# EasyEDA Pro project ProPrj_NE564_2025-07-16.epro

# Schematic NE564
Board Name: NE564; Create Date: 2025-07-15; Page Name: Sheet_1; Project Name: NE564; Schematic Name: NE564; Update Date: 2025-07-15; Add into BOM: yes; Company: NJU 2022; Convert to PCB: yes; Date: 2022-07-18; Draw By: Klein; REV: 1.0; Sheet: 1/1; spicePre: .
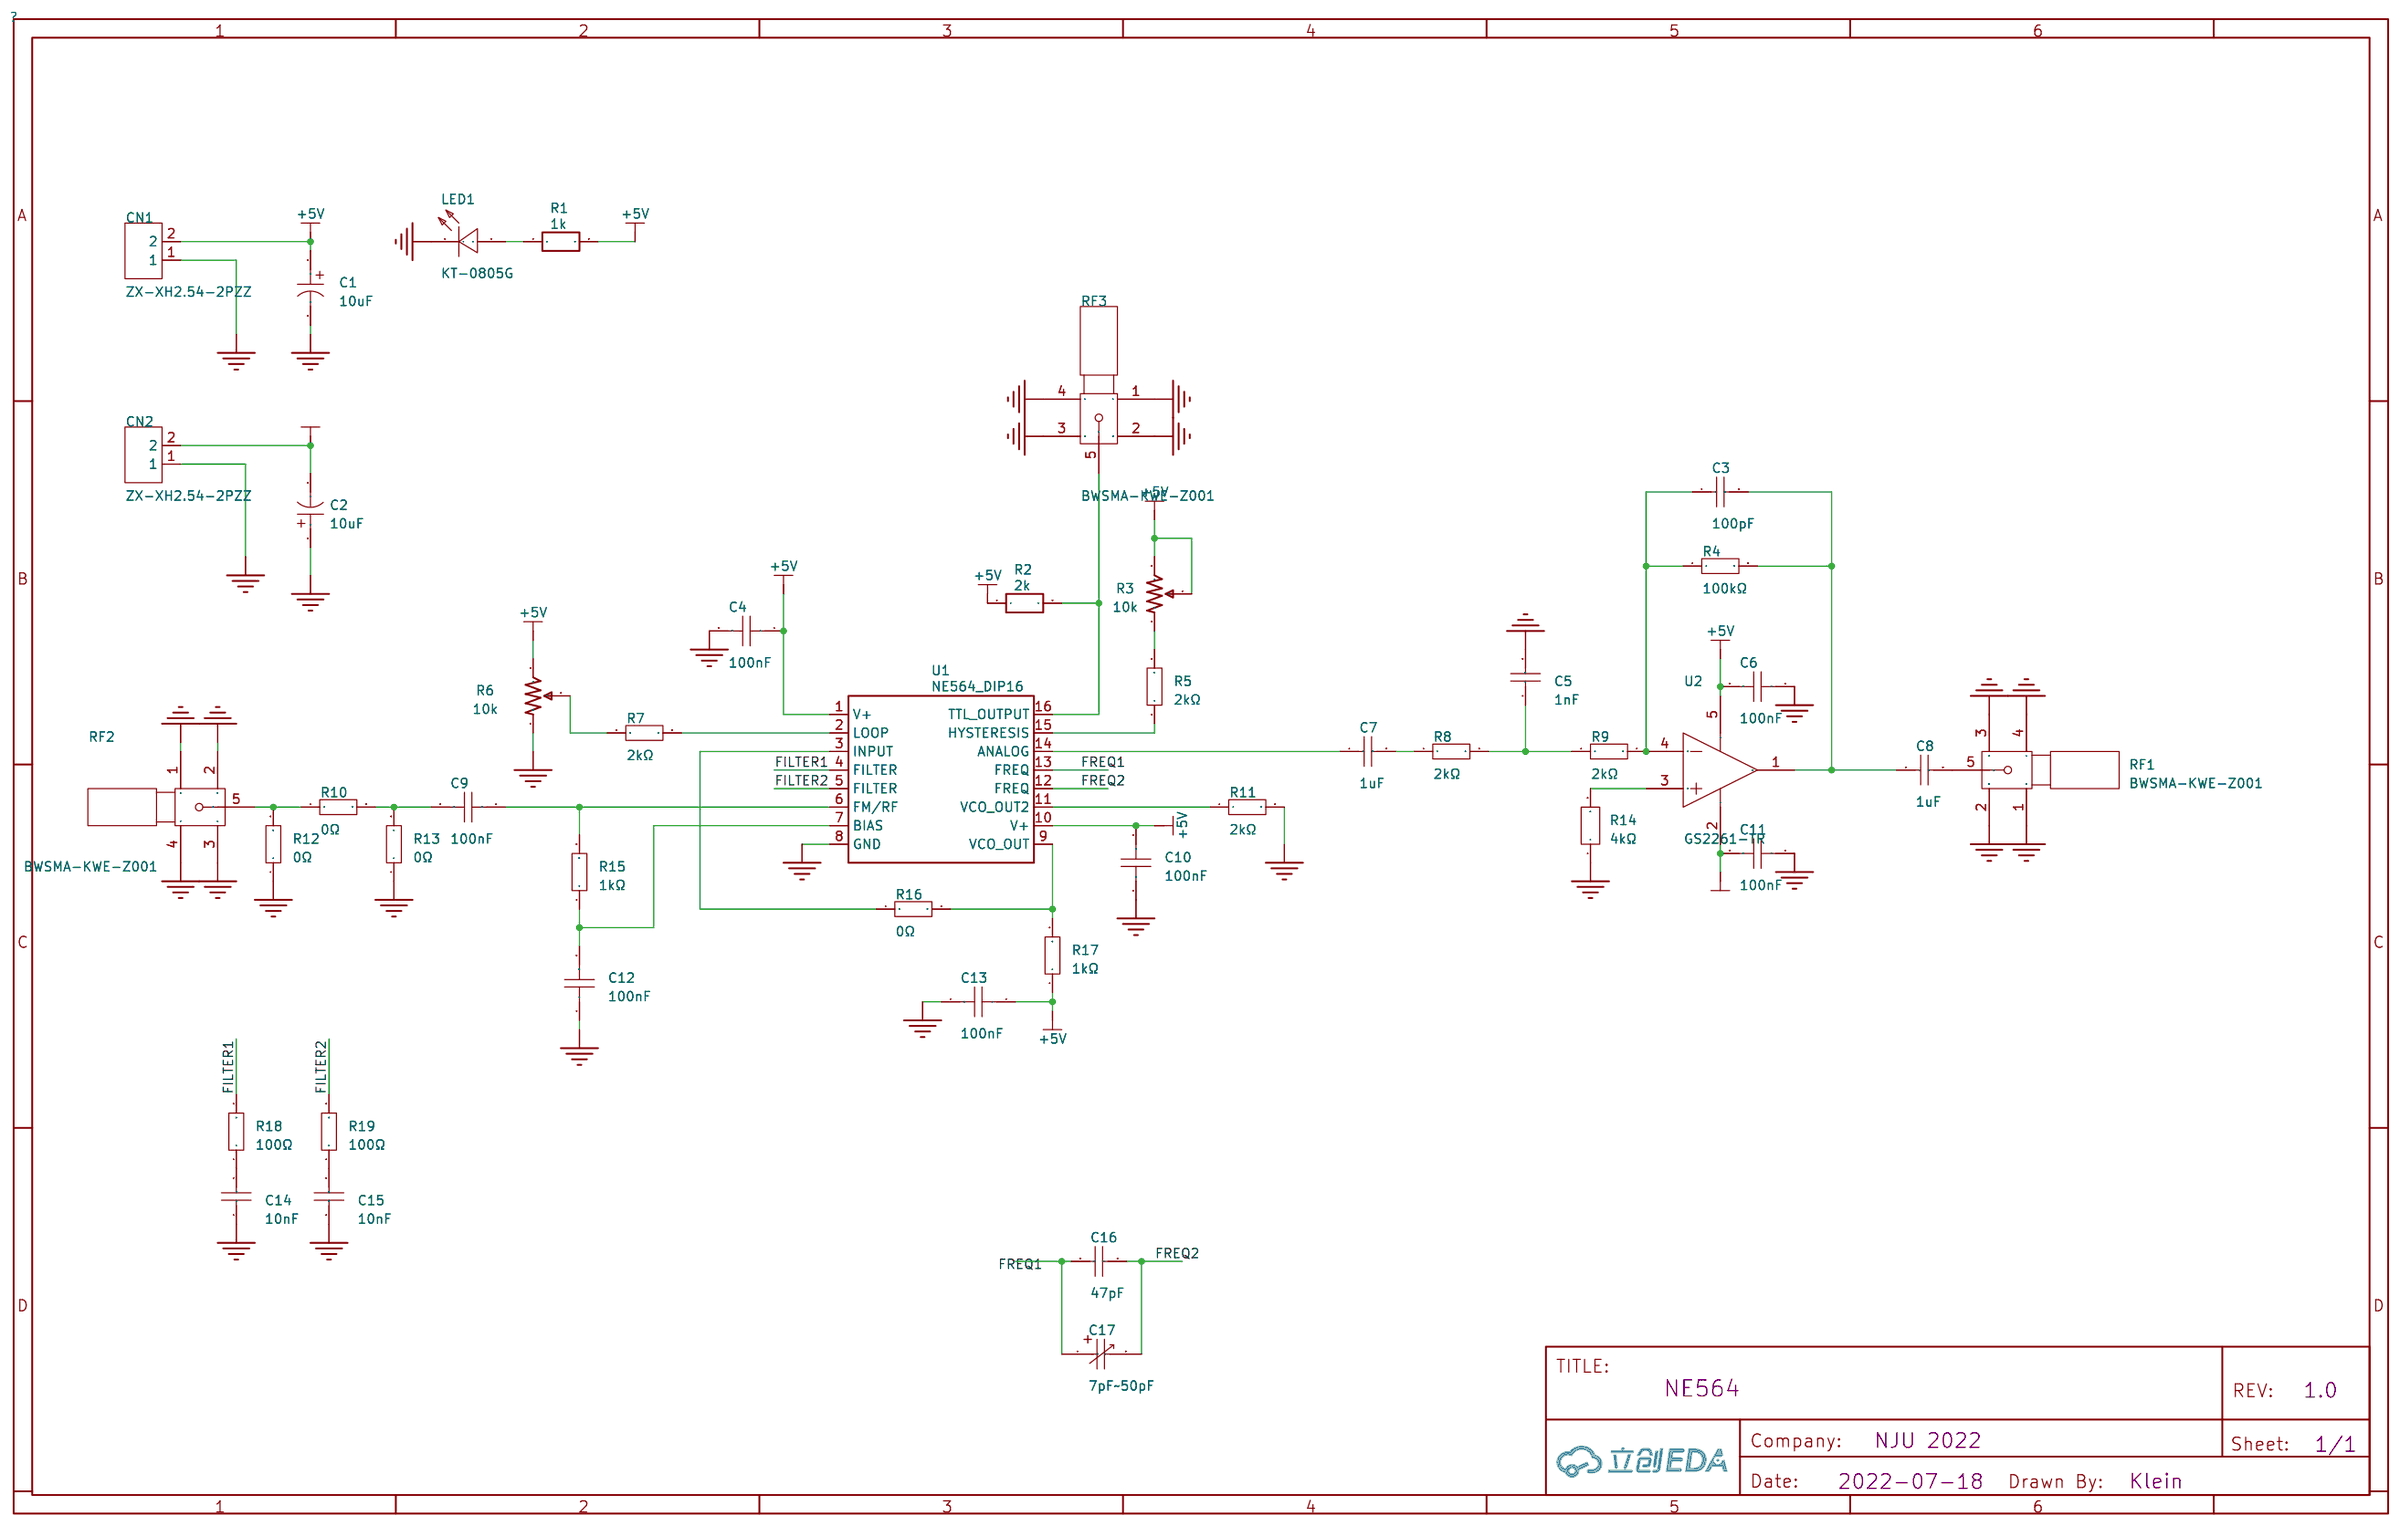
[diagram p0: schematic sheet]

## Parts
C1  10uF  [CAP-SMD_BD5.0-L5.3-W5.3-LS6.0-FD]
C2  10uF  [CAP-SMD_BD5.0-L5.3-W5.3-LS6.0-FD]
C3  100pF  [C0603]
C4  100nF  [C0805]
C5  1nF  [C0805]
C6  100nF  [C0805]
C7  1uF  [C0805]
C8  1uF  [C0805]
C9  100nF  [C0805]
C10  100nF  [C0805]
C11  100nF  [C0805]
C12  100nF  [C0805]
C13  100nF  [C0805]
C14  10nF  [C0805]
C15  10nF  [C0805]
C16  47pF  [C0805]
C17  7pF~50pF  [CAP-ADJ-SMD_L4.5-W4.2-L]
CN1  ZX-XH2.54-2PZZ  [CONN-TH_2P-P2.50_HX25003-2A]
CN2  ZX-XH2.54-2PZZ  [CONN-TH_2P-P2.50_HX25003-2A]
LED1  KT-0805G  [LED0805-R-RD]
R1  1k  [R0805]
R2  2k  [R0805]
R3  10k  [RES-ADJ-TH_3296W]
R4  100kΩ  [R0805]
R5  2kΩ  [R0805]
R6  10k  [RES-ADJ-TH_3296W]
R7  2kΩ  [R0805]
R8  2kΩ  [R0805]
R9  2kΩ  [R0805]
R10  0Ω  [R0805]
R11  2kΩ  [R0805]
R12  0Ω  [R0805]
R13  0Ω  [R0805]
R14  4kΩ  [R0805]
R15  1kΩ  [R0805]
R16  0Ω  [R0805]
R17  1kΩ  [R0805]
R18  100Ω  [R0805]
R19  100Ω  [R0805]
RF1  BWSMA-KWE-Z001  [SMA-TH_BWSMA-KWE-Z001]
RF2  BWSMA-KWE-Z001  [SMA-TH_BWSMA-KWE-Z001]
RF3  BWSMA-KWE-Z001  [SMA-TH_BWSMA-KWE-Z001]
U1  NE564_DIP16  [DIP16]
U2  GS2261-TR  [SOT-23-5_L3.0-W1.7-P0.95-LS2.8-BL]

## Library data of the parts
C1 C2 = JVJ50v10M5x5: 容值:10uF;精度:±20%;额定电压:50V;纹波电流:18mA@120Hz;; LCSC Part Name: 10uF ±20% 50V; Supplier Part: C46550416; Manufacturer: 捷而瑞; Supplier Footprint: SMD,D5xL5.4mm; JLCPCB Part Class: 扩展库; Datasheet: https://atta.szlcsc.com/upload/public/pdf/source/20250526/372E583B5965CEB57A276EA554306514.pdf; Supplier: LCSC; Tolerance: ±20%; Voltage Rating: 50V; Ripple Current: 18mA@120Hz; Diameter: 5mm; Height - Seated (Max): 5.4mm; Operating Temperature: -55℃~+105℃
C3 = CL10C101JB8NNNC: 容值:100pF;精度:±5%;额定电压:50V;材质(温度系数):C0G;; LCSC Part Name: 100pF ±5% 50V; Supplier Part: C14858; Manufacturer: SAMSUNG(三星); Supplier Footprint: 0603; JLCPCB Part Class: 基础库; Datasheet: https://atta.szlcsc.com/upload/public/pdf/source/20160218/1457707763339.pdf; Supplier: LCSC; Tolerance: ±5%; Voltage Rated: 50V; Temperature Coefficient: C0G
C4 C6 C9-C13 = CC0805KRX7R9BB104: 容值:100nF;精度:±10%;额定电压:50V;材质(温度系数):X7R;; LCSC Part Name: 100nF ±10% 50V; Supplier Part: C49678; Manufacturer: YAGEO(国巨); Supplier Footprint: 0805; JLCPCB Part Class: 基础库; Datasheet: https://atta.szlcsc.com/upload/public/pdf/source/20180224/C181747_15194369449651363981.pdf; Supplier: LCSC; Tolerance: ±10%; Voltage Rated: 50V; Temperature Coefficient: X7R
C5 = CL21B102KBCNNNC: 容值:1nF;精度:±10%;额定电压:50V;材质(温度系数):X7R;; LCSC Part Name: 1nF ±10% 50V; Supplier Part: C46653; Manufacturer: SAMSUNG(三星); Supplier Footprint: 0805; JLCPCB Part Class: 基础库; Datasheet: https://atta.szlcsc.com/upload/public/pdf/source/20160218/1457707763339.pdf; Supplier: LCSC; Tolerance: ±10%; Voltage Rated: 50V; Temperature Coefficient: X7R
C7 C8 = CL21B105KBFNNNE: 容值:1uF;精度:±10%;额定电压:50V;材质(温度系数):X7R;; LCSC Part Name: 1uF ±10% 50V; Supplier Part: C28323; Manufacturer: SAMSUNG(三星); Supplier Footprint: 0805; JLCPCB Part Class: 基础库; Datasheet: https://atta.szlcsc.com/upload/public/pdf/source/20160218/1457707763339.pdf; Supplier: LCSC; Tolerance: ±10%; Voltage Rated: 50V; Temperature Coefficient: X7R
C14 C15 = CL21B103KBANNNC: 容值:10nF;精度:±10%;额定电压:50V;材质(温度系数):X7R;; LCSC Part Name: 10nF ±10% 50V; Supplier Part: C1710; Manufacturer: SAMSUNG(三星); Supplier Footprint: 0805; JLCPCB Part Class: 基础库; Datasheet: https://atta.szlcsc.com/upload/public/pdf/source/20160218/1457707763339.pdf; Supplier: LCSC; Tolerance: ±10%; Voltage Rated: 50V; Temperature Coefficient: X7R
C16 = CL21C470JBANNNC: 容值:47pF;精度:±5%;额定电压:50V;材质(温度系数):C0G;; LCSC Part Name: 47pF ±5% 50V; Supplier Part: C14857; Manufacturer: SAMSUNG(三星); Supplier Footprint: 0805; JLCPCB Part Class: 基础库; Datasheet: https://atta.szlcsc.com/upload/public/pdf/source/20160218/1457707763339.pdf; Supplier: LCSC; Tolerance: ±5%; Voltage Rated: 50V; Temperature Coefficient: C0G
C17 = TZB4R500AB10R00: 静电容量:7pF~50pF;静电容量公差:0%~+100%;额定电压:50V;电荷量:300@1MHz;; LCSC Part Name: 7pF~50pF 0%~+100% 50V 300@1MHz; Supplier Part: C125363; Manufacturer: muRata(村田); Supplier Footprint: SMD,4x4.5mm; JLCPCB Part Class: 扩展库; Datasheet: https://atta.szlcsc.com/upload/public/pdf/source/20170810/C125363_1502335363337879940.pdf; Supplier: LCSC; Tolerance: 0%~+100%; Voltage Rating: 50V; Q @ Frequency: 300@1MHz; Operating Temperature: -25℃~+85℃
CN1 CN2 = ZX-XH2.54-2PZZ: 插针结构:1x2P;间距:2.5mm;安装方式:直插;参考系列:XH;总PIN数:2P;排数:1;每排PIN数:2;行距:-;额定电流:3A;触头材质:黄铜;触头镀层:锡;工作温度:-25℃~+85℃;; LCSC Part Name: 1x2P 间距:2.5mm 直插 系列:XH; Supplier Part: C7429632; Manufacturer: Megastar(兆星); Supplier Footprint: 插件,P=2.5mm; JLCPCB Part Class: 扩展库; Datasheet: https://atta.szlcsc.com/upload/public/pdf/source/20230619/19BA6947230AA44A04D3EDD65E618FD0.pdf; Supplier: LCSC; Pins Structure: 1x2P; Pitch: 2.5mm; Mounting Type: 直插; Reference Series: XH; Number of Pins: 2P; Number of Rows: 1; Number of PINs Per Row: 2; Current Rating: 3A; Contact Material: 黄铜; Contact Plating: 锡; Operating Temperature: -25℃~+85℃; Voltage Rating: 250V; Plastic Material: PA66; Flame Retardant Rating: UL94V-0; Color: 白色; Z-Height of the Board: 7mm; X-Length of Bottom Edge on Board (Spacing Line): 7.5mm; Y-Width of Bottom Edge on Board: 5.9mm
LED1 = KT-0805G: 灯头类型:-;发光颜色:翠绿色;正向电压(VF):-;功率:-;正向电流:-;主波长:-;二极管配置:-;透镜颜色:-;色温:-;发光强度:-;发光角度:-;载带方式:-;工作温度:-;; LCSC Part Name: 0805 翠绿 高亮; Supplier Part: C2297; Manufacturer: KENTO; Supplier Footprint: 0805; JLCPCB Part Class: 基础库; Datasheet: https://atta.szlcsc.com/upload/public/pdf/source/20170209/1486607340485.pdf; Supplier: LCSC; Emitted Color: 翠绿色
R1 = 1k: nameAlias: Value(Ω); Contributor: LCEDA_Lib; spicePre: R; spiceSymbolName: R_0805_EU
R2 = 2k: nameAlias: Value(Ω); Contributor: LCEDA_Lib; spicePre: R; spiceSymbolName: R_0805_EU
R3 R6 = 10k: Supplier: LCSC; value(Ω): 10K; nameAlias: Value; Contributor: LCEDA_Lib; spicePre: R; spiceSymbolName: R_3296W_US
R4 = 0805W8F1003T5E: 电阻类型:厚膜电阻;阻值:100kΩ;精度:±1%;功率:125mW;最大工作电压:150V;温度系数:±100ppm/℃;; LCSC Part Name: 100kΩ ±1% 125mW 厚膜电阻; Supplier Part: C149504; Manufacturer: UNI-ROYAL(厚声); Supplier Footprint: 0805; JLCPCB Part Class: 基础库; Datasheet: https://atta.szlcsc.com/upload/public/pdf/source/20200306/C422600_1E6D84923E4A46A82E41ADD87F860B5C.pdf; Supplier: LCSC; Type: 厚膜电阻; Tolerance: ±1%; Power(Watts): 125mW; Overload Voltage (Max): 150V; Temperature Coefficient: ±100ppm/℃; Operating Temperature Range: -55℃~+155℃
R5 R7-R9 R11 = 0805W8F2001T5E: 电阻类型:厚膜电阻;阻值:2kΩ;精度:±1%;功率:125mW;最大工作电压:150V;温度系数:±100ppm/℃;; LCSC Part Name: 2kΩ ±1% 125mW 厚膜电阻; Supplier Part: C17604; Manufacturer: UNI-ROYAL(厚声); Supplier Footprint: 0805; JLCPCB Part Class: 基础库; Datasheet: https://atta.szlcsc.com/upload/public/pdf/source/20200306/C422600_1E6D84923E4A46A82E41ADD87F860B5C.pdf; Supplier: LCSC; Type: 厚膜电阻; Tolerance: ±1%; Power(Watts): 125mW; Overload Voltage (Max): 150V; Temperature Coefficient: ±100ppm/℃; Operating Temperature Range: -55℃~+155℃
R10 R12 R13 R16 = 0805W8F0000T5E: 电阻类型:厚膜电阻;阻值:0Ω;精度:±1%;功率:125mW;最大工作电压:150V;温度系数:±800ppm/℃;; LCSC Part Name: 0Ω ±1% 125mW 厚膜电阻; Supplier Part: C17477; Manufacturer: UNI-ROYAL(厚声); Supplier Footprint: 0805; JLCPCB Part Class: 基础库; Datasheet: https://atta.szlcsc.com/upload/public/pdf/source/20200306/C422600_1E6D84923E4A46A82E41ADD87F860B5C.pdf; Supplier: LCSC; Type: 厚膜电阻; Tolerance: ±1%; Power(Watts): 125mW; Overload Voltage (Max): 150V; Temperature Coefficient: ±800ppm/℃; Operating Temperature Range: -55℃~+155℃
R14 = ARG05FTC4001N: 电阻类型:薄膜电阻;阻值:4kΩ;精度:±1%;功率:125mW;最大工作电压:150V;温度系数:±25ppm/℃;; LCSC Part Name: 薄膜电阻 4kΩ ±1% 125mW; Supplier Part: C2828855; Manufacturer: Viking(光颉); Supplier Footprint: 0805; JLCPCB Part Class: 扩展库; Datasheet: https://atta.szlcsc.com/upload/public/pdf/source/20211009/C2828883_CAE7D170B8B230FC4A048BDC7B3A81FC.pdf; Supplier: LCSC; Type: 薄膜电阻; Tolerance: ±1%; Power(Watts): 125mW; Overload Voltage (Max): 150V; Temperature Coefficient: ±25ppm/℃; Operating Temperature Range: -55℃~+155℃
R15 R17 = 0805W8F1001T5E: 电阻类型:厚膜电阻;阻值:1kΩ;精度:±1%;功率:125mW;最大工作电压:150V;温度系数:±100ppm/℃;; LCSC Part Name: 1kΩ ±1% 125mW 厚膜电阻; Supplier Part: C17513; Manufacturer: UNI-ROYAL(厚声); Supplier Footprint: 0805; JLCPCB Part Class: 基础库; Datasheet: https://atta.szlcsc.com/upload/public/pdf/source/20200306/C422600_1E6D84923E4A46A82E41ADD87F860B5C.pdf; Supplier: LCSC; Type: 厚膜电阻; Tolerance: ±1%; Power(Watts): 125mW; Overload Voltage (Max): 150V; Temperature Coefficient: ±100ppm/℃; Operating Temperature Range: -55℃~+155℃
R18 R19 = 0805W8F1000T5E: 电阻类型:厚膜电阻;阻值:100Ω;精度:±1%;功率:125mW;最大工作电压:150V;温度系数:±100ppm/℃;; LCSC Part Name: 100Ω ±1% 125mW 厚膜电阻; Supplier Part: C17408; Manufacturer: UNI-ROYAL(厚声); Supplier Footprint: 0805; JLCPCB Part Class: 基础库; Datasheet: https://atta.szlcsc.com/upload/public/pdf/source/20200306/C422600_1E6D84923E4A46A82E41ADD87F860B5C.pdf; Supplier: LCSC; Type: 厚膜电阻; Tolerance: ±1%; Power(Watts): 125mW; Overload Voltage (Max): 150V; Temperature Coefficient: ±100ppm/℃; Operating Temperature Range: -55℃~+155℃
RF1-RF3 = BWSMA-KWE-Z001: 连接器类型:板端;接口类型:内孔;端口数量:1;接口直径:5.3mm;接口长度/高度:-;频率-最大值:-;射频系列:SMA;阻抗:50Ω;样式:弯头;触头材质:-;触头镀层:-;工作温度范围:-;焊接温度(最大值):-;; LCSC Part Name: 内孔 SMA 弯头; Supplier Part: C496551; Manufacturer: BAT WIRELESS(蝙蝠无线); Supplier Footprint: 插件; JLCPCB Part Class: 扩展库; Datasheet: https://atta.szlcsc.com/upload/public/pdf/source/20231017/997A8C2ADA7F8034A89BE1264F38CE52.pdf; Supplier: LCSC; Connector Type: 板端; Interface Type: 内孔; Number of Ports: 1; Interface Diameter: 5.3mm; RF Series: SMA; Impedance: 50Ω; Style: 弯头
U1 = NE564: Supplier: LCSC; Supplier Part: C219007; Manufacturer: Shenzhen Nsiway Tech; Contributor: Raincorn; spicePre: U
U2 = GS2261-TR: 放大器数:单路;轨到轨:-;增益带宽积(GBP):-;输入失调电压(Vos):100uV;压摆率(SR):23V/us;输入偏置电流(Ib):100pA;; Supplier Part: C6283803; Manufacturer: Gainsil(聚洵); Supplier Footprint: SOT23-5; JLCPCB Part Class: 扩展库; Datasheet: https://atta.szlcsc.com/upload/public/pdf/source/20230523/CC91D60E350C7B0E764F087BC04736B1.pdf; Supplier: LCSC; Number of Channels: 单路; Maximum Power Supply Range (Vdd-Vss): 36V; Vos - Input Offset Voltage: 100uV; Input Offset Voltage Drift(Vos TC): 2uV/℃; Slew Rate: 23V/us; Ib - Input Bias Current: 100pA; Noise density(eN): 34nV/√Hz@1kHz; Common Mode Rejection Ratio(CMRR): 120dB; Operating Temperature: -40℃~+125℃; Single supply: 3.3V~36V

## Nets
+5V: C1.1 C4.1 C6.2 C10.2 C13.1 CN1.2 R1.2 R2.1 R3.2 R3.3 R6.3 R17.1 U1.1(V+) U1.10(V+) U2.5(V+)
-5V: C2.2 C11.2 CN2.2 U2.2(V-)
GND: C1.2 C2.1 C4.2 C5.2 C6.1 C10.1 C11.1 C12.1 C13.2 C14.1 C15.1 CN1.1 CN2.1 LED1.2(K) R6.1 R11.2 R12.1 R13.1 R14.1 RF1.1 RF1.2 RF1.3 RF1.4 RF2.1 RF2.2 RF2.3 RF2.4 RF3.1 RF3.2 RF3.3 RF3.4 U1.8(GND)
FILTER1: R18.2 U1.4(FILTER)
FILTER2: R19.2 U1.5(FILTER)
FREQ1: C16.1 C17.1 U1.13(FREQ)
FREQ2: C16.2 C17.2 U1.12(FREQ)
$1N33: C7.2 R8.1
$1N34: C5.1 R8.2 R9.1
$1N52: LED1.1(A) R1.1
$1N6764: C9.2 R10.2 R13.2
Net-(C3-1): C3.1 R4.1 R9.2 U2.4(IN-)
Net-(C3-2): C3.2 C8.1 R4.2 U2.1(OUT)
Net-(C7-1): C7.1 U1.14(ANALOG)
Net-(C8-2): C8.2 RF1.5
Net-(C9-1): C9.1 R15.2 U1.6(FM/RF)
Net-(C12-2): C12.2 R15.1 U1.7(BIAS)
Net-(C14-2): C14.2 R18.1
Net-(C15-2): C15.2 R19.1
Net-(R2-2): R2.2 RF3.5 U1.16(TTL OUTPUT)
Net-(R3-1): R3.1 R5.2
Net-(R5-1): R5.1 U1.15(HYSTERESIS)
Net-(R6-2): R6.2 R7.1
Net-(R7-2): R7.2 U1.2(LOOP)
Net-(R10-1): R10.1 R12.2 RF2.5
Net-(R11-1): R11.1 U1.11(VCO OUT2)
Net-(R14-2): R14.2 U2.3(IN+)
Net-(R16-1): R16.1 U1.3(INPUT)
Net-(R16-2): R16.2 R17.2 U1.9(VCO OUT)

# Board 1-PCB_PCB_NE564
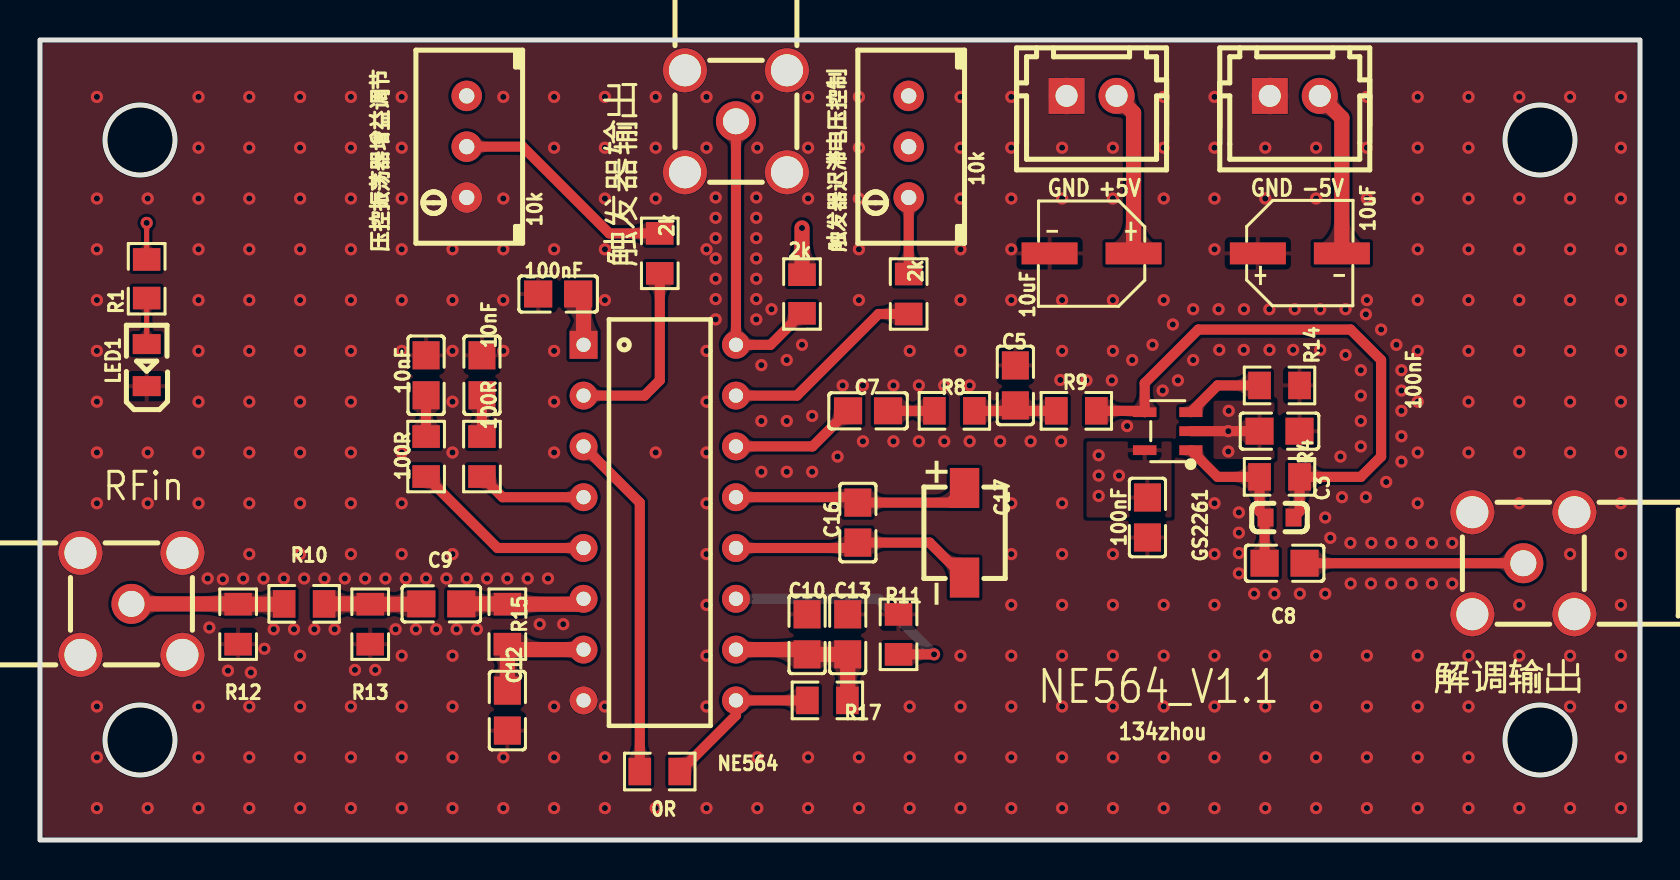
[diagram p1: board, top side]
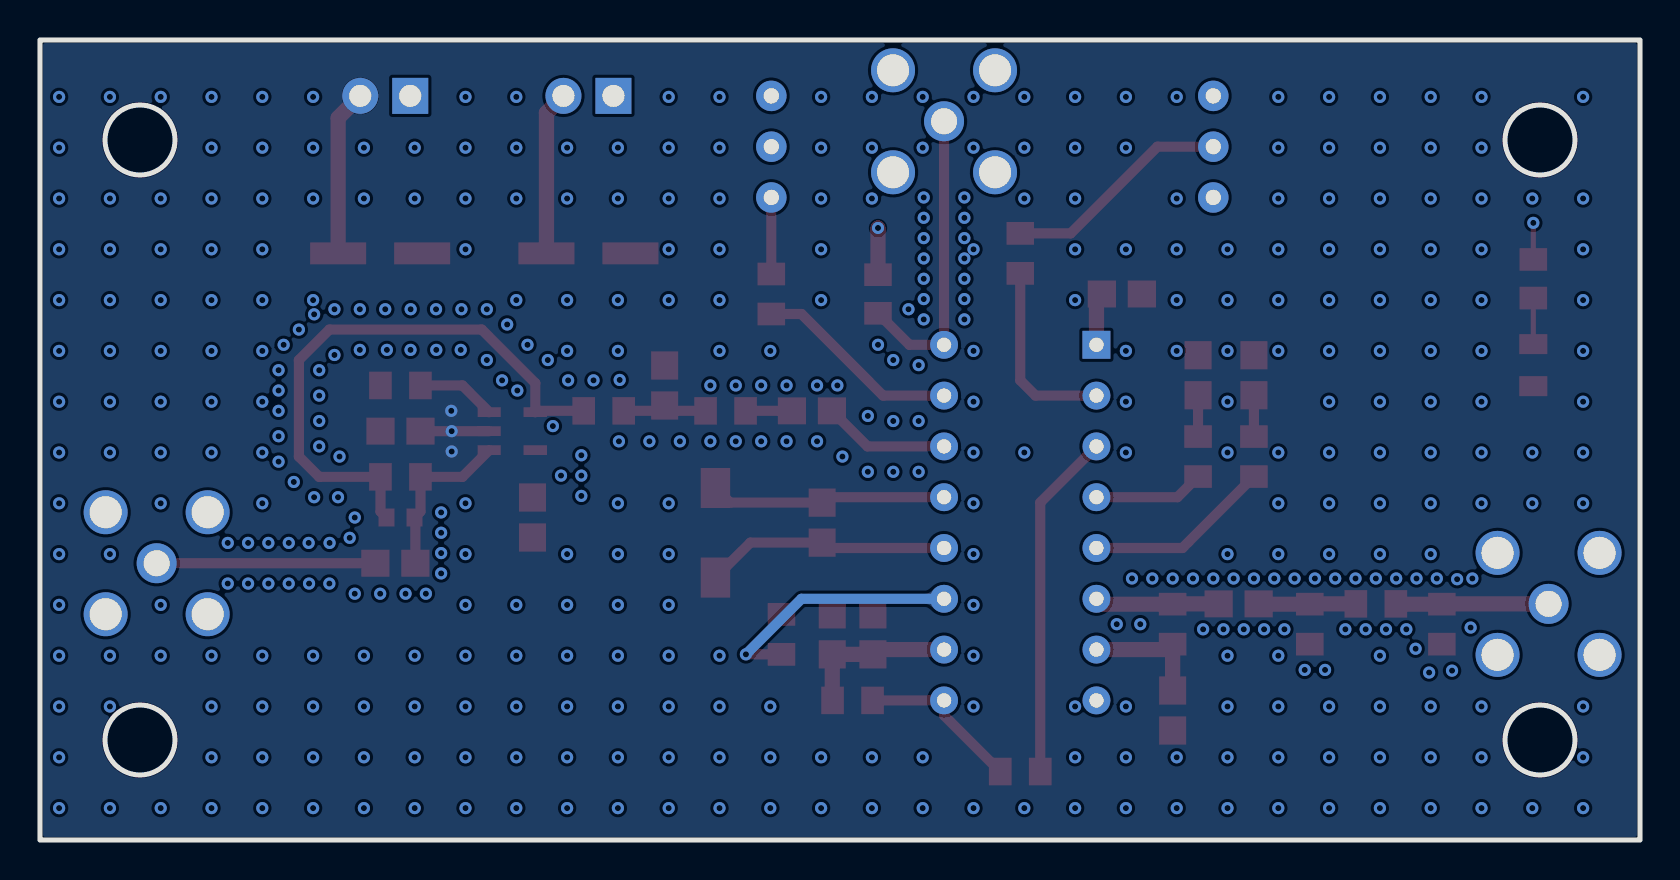
[diagram p2: board, bottom side, seen from below]

Outline 80 x 40 mm; copper layers: Top Layer, Inner1, Inner2, Bottom Layer. Coordinates in mm from the lower left corner of the outline.
Outline path: rectangle 0,40 80,0 ; circle c5,35 r1.75 ; circle c5,5 r1.75 ; circle c75,35 r1.75 ; circle c75,5 r1.75
Stack: Top Layer 0.035mm 外层铜厚1oz / Dielectric1 0.2104mm 7628 RC49% 8.6mil / Inner1 0.0152mm 内层铜厚 / Dielectric2 1.065mm 1.1mm H/HOZ Copper / Inner2 0.0152mm 内层铜厚 / Dielectric3 0.2104mm 7628 RC49% 8.6mil / Bottom Layer 0.035mm 外层铜厚1oz

## Design rules (mm)
spacing Default (default): track to track 0.152, other pairs 0 to 0.152
track width Default (default): min 0.254, default 0.254, max 25.4
differential pair differentialPair (default): width min 0.127, default 0.254, max 2.54; gap min 0.152, default 0.152
via Default (default): diameter min 0.61, default 0.61, max 100.025; hole min 0.305, default 0.305, max 59.995

## Placement (name value [footprint] x y rotation side)
0R  0Ω  [R0805#2]  30.99 3.42 0 top
2k  -  [R0805]  38.1 27.3 270 top
2k#2  -  [R0805#2]  30.99 29.33 270 top
2k#3  -  [R0805#2]  43.43 27.3 90 top
10k  -  [RES-ADJ-TH_3296W]  43.43 34.67 180 top
10k#2  -  [RES-ADJ-TH_3296W]  21.34 34.67 180 top
10nF  -  [C0805]  19.3 23.24 270 top
10nF#2  -  [C0805]  22.1 23.24 270 top
10uF  -  [CAP-SMD_BD5.0-L5.3-W5.3-LS6.0-FD]  52.58 29.33 180 top
10uF#2  -  [CAP-SMD_BD5.0-L5.3-W5.3-LS6.0-FD]  62.99 29.33 0 top
100nF  -  [C0805]  25.91 27.3 180 top
100nF#2  -  [C0805]  55.37 16.12 90 top
100nF#3  -  [C0805]  61.98 20.44 180 top
100R  -  [R0805#2]  22.1 19.17 270 top
100R#2  -  [R0805#2]  19.3 19.17 270 top
C3  100pF  [C0603]  61.98 16.12 180 top
C5  1nF  [C0805]  48.77 22.73 90 top
C7  1uF  [C0805]  41.4 21.46 0 top
C8  1uF  [C0805]  62.23 13.84 0 top
C9  100nF  [C0805]  20.07 11.81 180 top
C10  100nF  [C0805]  38.35 10.28 270 top
C12  100nF  [C0805]  23.37 6.47 90 top
C13  100nF  [C0805]  40.39 10.28 90 top
C16  47pF  [C0805]  40.89 15.87 270 top
C17  7pF~50pF  [CAP-ADJ-SMD_L4.5-W4.2-L]  46.23 15.36 270 top
CN1  ZX-XH2.54-2PZZ  [CONN-TH_2P-P2.50_HX25003-2A]  52.58 37.21 0 top
CN2  ZX-XH2.54-2PZZ  [CONN-TH_2P-P2.50_HX25003-2A]  62.74 37.21 0 top
GS2261  GS2261-TR  [SOT-23-5_L3.0-W1.7-P0.95-LS2.8-BL]  56.39 20.44 90 top
LED1  KT-0805G  [LED0805-R-RD]  5.33 23.74 90 top
NE564  NE564_DIP16  [DIP16]  30.99 15.87 270 top
R1  1k  [R0805]  5.33 28.06 90 top
R4  100kΩ  [R0805#2]  61.98 18.16 180 top
R8  2kΩ  [R0805#2]  45.72 21.46 0 top
R9  2kΩ  [R0805#2]  51.82 21.46 0 top
R10  0Ω  [R0805#2]  13.21 11.81 0 top
R11  2kΩ  [R0805#2]  42.93 10.28 90 top
R12  0Ω  [R0805#2]  9.91 10.79 90 top
R13  0Ω  [R0805#2]  16.51 10.79 90 top
R14  4kΩ  [R0805#2]  61.98 22.73 180 top
R15  1kΩ  [R0805#2]  23.37 10.79 90 top
R17  1kΩ  [R0805#2]  39.37 6.98 180 top
RFin  BWSMA-KWE-Z001  [SMA-TH_BWSMA-KWE-Z001]  4.57 11.81 180 top
解调输出  BWSMA-KWE-Z001  [SMA-TH_BWSMA-KWE-Z001]  74.17 13.84 0 top
触发器输出  BWSMA-KWE-Z001  [SMA-TH_BWSMA-KWE-Z001]  34.8 35.94 90 top

## Footprints (pads in the part's own frame, mm; a bottom-side part is the same pattern mirrored in y, then rotated)
C0603
  rect 0.8x0.9 smd: 1(-0.7,0) 2(0.7,0)
C0805
  rect 1.41x1.35 smd: 1(-1,0) 2(1,0)
CAP-ADJ-SMD_L4.5-W4.2-L
  rect 2x1.47 smd: 1(-2.24,0) 2(2.24,0)
CAP-SMD_BD5.0-L5.3-W5.3-LS6.0-FD
  rect 2.8x1.1 smd: 1(-2.1,0) 2(2.1,0)
CONN-TH_2P-P2.50_HX25003-2A
  rect 1.8x1.8 hole 1.1: 1(-1.25,0)
  round 1.8 hole 1.1: 2(1.25,0)
DIP16
  rect 1.397x1.397 hole 0.711: 1(-8.89,-3.81)
  round 1.397 hole 0.711: 2(-6.35,-3.81) 3(-3.81,-3.81) 4(-1.27,-3.81) 5(1.27,-3.81) 6(3.81,-3.81) 7(6.35,-3.81) 8(8.89,-3.81) 9(8.89,3.81) 10(6.35,3.81) 11(3.81,3.81) 12(1.27,3.81) 13(-1.27,3.81) 14(-3.81,3.81) 15(-6.35,3.81) 16(-8.89,3.81)
LED0805-R-RD
  rect 1x1.399 smd: 1(1.05,0) 2(-1.05,0)
R0805
  rect 1.133x1.377 smd: 1(-0.966,0) 2(0.966,0)
R0805#2
  rect 1.133x1.377 smd: 1(-1,0) 2(1,0)
RES-ADJ-TH_3296W
  round 1.524 hole 0.762: 1(0,2.54) 2(0,0) 3(0,-2.54)
SMA-TH_BWSMA-KWE-Z001
  round 2.2 hole 1.6: 1(-2.55,-2.55) 2(-2.55,2.55) 3(2.55,2.55) 4(2.55,-2.55)
  round 2 hole 1.3: 5(0,0)
SOT-23-5_L3.0-W1.7-P0.95-LS2.8-BL
  rect 0.49x1.157 smd: 1(-0.95,-1.153) 2(0,-1.153) 3(0.95,-1.153)
  rect 0.49x1.175 smd: 4(0.95,1.153) 5(-0.95,1.153)

## Nets
+5V: 2k.1 10k.2 10k.3 10k#2.3 10uF.1 100nF.1 100nF#2.2 C10.2 C13.1 CN1.2 GS2261.5 NE564.1 NE564.10 R1.2 R17.1
-5V: 10uF#2.2 100nF#3.2 CN2.2 GS2261.2
GND: 10k#2.1 10nF.1 10nF#2.1 10uF.2 10uF#2.1 100nF.2 100nF#2.1 100nF#3.1 C5.2 C10.1 C12.1 C13.2 CN1.1 CN2.1 LED1.2 NE564.8 R11.2 R12.1 R13.1 R14.1 RFin.1 RFin.2 RFin.3 RFin.4 解调输出.1 解调输出.2 解调输出.3 解调输出.4 触发器输出.1 触发器输出.2 触发器输出.3 触发器输出.4
FILTER1: 100R.2 NE564.4
FILTER2: 100R#2.2 NE564.5
FREQ1: C16.1 C17.1 NE564.13
FREQ2: C16.2 C17.2 NE564.12
$1N3: C9.1 NE564.6 R15.2
$1N9: 0R.1 NE564.3
$1N11: C12.2 NE564.7 R15.1
$1N13: 2k#2.1 10k#2.2
$1N15: 2k#2.2 NE564.2
$1N18: 0R.2 NE564.9 R17.2
$1N22: NE564.11 R11.1
$1N27: 2k.2 NE564.16 触发器输出.5
$1N30: 2k#3.2 10k.1
$1N31: 2k#3.1 NE564.15
$1N32: C7.1 NE564.14
$1N33: C7.2 R8.1
$1N34: C5.1 R8.2 R9.1
$1N52: LED1.1 R1.1
$1N3078: 10nF#2.2 100R.1
$1N3114: 10nF.2 100R#2.1
$1N6036: C3.1 GS2261.4 R4.1 R9.2
$1N6106: GS2261.3 R14.2
$1N6224: C3.2 C8.1 GS2261.1 R4.2
$1N6416: C8.2 解调输出.5
$1N6764: C9.2 R10.2 R13.2
$1N6766: R10.1 R12.2 RFin.5

## Via types
v1: diameter 0.61, hole 0.305, Top Layer to Bottom Layer, 441 vias

## Routing (per net, layer and track width the routed paths; a pad name or vN(x,y) marks a point on that pad's centre or on a via; arc(x,y) is an arc through that point)
+5V: length 23
  Top Layer w0.254: R1.2 v1(5.33,30.86)
  Top Layer w0.762: CN1.2 54.68,36.36 10uF.1 ; R17.1 40.39,7 C13.1 C10.2 38.12,9.52 NE564.10 ; 100nF.1 27.18,27.03 NE564.1 ; 2k.1 v1(38.1,30.6)
  vias: v1(52.93,19.24) v1(52.93,18.22) v1(52.93,17.2) v1(53.95,18.22)
-5V: length 11.8
  Top Layer w0.508: GS2261.2 v1(59.42,20.44) 100nF#3.2
  Top Layer w0.762: CN2.2 65.09,36.1 10uF#2.2
  vias: v1(59.44,21.46) v1(59.42,19.43)
GND:
  vias: v1(2.84,37.16) v1(2.84,32.08) v1(2.84,29.53) v1(2.84,27) v1(2.84,24.45) v1(2.84,21.92) v1(2.84,19.38) v1(2.84,16.83) v1(2.84,6.67) v1(2.84,4.14) v1(2.84,1.59) v1(5.39,32.08) v1(5.39,19.38) v1(5.39,16.83) v1(5.39,1.59) v1(7.92,37.16) v1(7.92,34.61) v1(7.92,32.08) v1(7.92,29.53) v1(7.92,27) v1(7.92,24.45) v1(7.92,21.92) v1(7.92,19.38) v1(7.92,16.83) v1(7.92,6.67) v1(7.92,4.14) v1(7.92,1.59) v1(8.38,13.08) v1(8.47,10.62) v1(9.14,13.04) v1(9.4,8.47) v1(10.16,13.08) v1(10.47,37.16) v1(10.47,34.61) v1(10.47,32.08) v1(10.47,29.53) v1(10.47,27) v1(10.47,24.45) v1(10.47,21.92) v1(10.47,19.38) v1(10.47,16.83) v1(10.47,14.3) v1(10.54,8.37) v1(10.47,6.67) v1(10.47,4.14) v1(10.47,1.59) v1(11.18,13.08) v1(11.22,9.56) v1(11.68,10.54) v1(12.19,13.08) v1(12.7,10.54) v1(13,37.16) v1(13,34.61) v1(13,32.08) v1(13,29.53) v1(13,27) v1(13,24.45) v1(13,21.92) v1(13,19.38) v1(13,16.83) v1(13,14.3) v1(13,9.22) v1(13,6.67) v1(13,4.14) v1(13,1.59) v1(13.21,13.08) v1(13.72,10.54) v1(14.22,13.08) v1(14.73,10.54) v1(15.24,13.08) v1(15.55,37.16) v1(15.55,34.61) v1(15.55,32.08) v1(15.55,29.53) v1(15.55,27) v1(15.55,24.45) v1(15.55,21.92) v1(15.55,19.38) v1(15.55,16.83) v1(15.55,14.3) v1(15.55,6.67) v1(15.55,4.14) v1(15.55,1.59) v1(15.75,8.5) v1(16.26,13.08) v1(16.76,8.5) v1(17.27,13.08) v1(17.78,10.54) v1(18.09,37.16) v1(18.09,34.61) v1(18.09,32.08) v1(18.09,29.53) v1(18.09,27) v1(18.09,24.45) v1(18.09,19.38) v1(18.09,16.83) v1(18.09,14.3) v1(18.09,9.22) v1(18.09,6.67) v1(18.09,4.14) v1(18.09,1.59) v1(18.29,13.08) v1(18.8,10.54) v1(19.3,13.08) v1(19.81,10.54) v1(20.32,13.08) v1(20.62,29.53) v1(20.62,27) v1(20.62,24.45) v1(20.62,21.92) v1(20.62,19.38) v1(20.62,14.3) v1(20.62,9.22) v1(20.62,6.67) v1(20.62,4.14) v1(20.62,1.59) v1(20.83,10.54) v1(21.34,13.08) v1(21.84,10.54) v1(22.35,13.08) v1(23.16,37.16) v1(23.16,32.08) v1(23.16,29.53) v1(23.16,27) v1(23.16,24.45) v1(23.16,4.14) v1(23.16,1.59) v1(23.37,13.08) v1(24.38,13.08) v1(24.99,10.79) v1(25.4,13.08) v1(25.71,37.16) v1(25.71,34.61) v1(25.71,29.53) v1(25.71,24.45) v1(25.71,21.92) v1(25.71,19.38) v1(25.71,6.67) v1(25.71,4.14) v1(25.71,1.59) v1(26.16,10.79) v1(28.25,37.16) v1(28.25,34.61) v1(28.25,32.08) v1(28.25,29.53) v1(28.25,27) v1(28.25,6.67) v1(28.25,4.14) v1(28.25,1.59) v1(30.78,37.16) v1(30.78,34.61) v1(30.78,32.08) v1(30.78,19.38) v1(30.78,1.59) v1(33.32,37.16) v1(33.32,34.61) v1(33.32,29.53) v1(33.32,24.45) v1(33.32,21.92) v1(33.32,19.38) v1(33.32,16.83) v1(33.32,14.3) v1(33.32,11.75) v1(33.32,9.22) v1(33.32,6.67) v1(33.32,1.59) v1(33.78,32.13) v1(33.78,31.11) v1(33.78,30.09) v1(33.78,29.08) v1(33.78,28.06) v1(33.78,27.05) v1(33.78,26.03) v1(35.81,32.13) v1(35.81,31.11) v1(35.81,30.09) v1(35.81,29.08) v1(35.81,28.06) v1(35.81,27.05) v1(35.81,26.03) v1(35.87,37.16) v1(35.87,34.61) v1(35.87,4.14) v1(35.87,1.59) v1(36.07,23.74) v1(36.07,20.95) v1(36.07,18.41) v1(36.58,26.54) v1(37.34,24) v1(37.34,20.95) v1(37.34,18.41) v1(38.1,24.76) v1(38.41,37.16) v1(38.41,34.61) v1(38.41,32.08) v1(38.41,4.14) v1(38.41,1.59) v1(38.61,21.2) v1(38.61,18.41) v1(39.88,19.17) v1(40.13,22.73) v1(40.94,37.16) v1(40.94,34.61) v1(40.94,32.08) v1(40.94,29.53) v1(40.94,27) v1(40.94,4.14) v1(40.94,1.59) v1(41.15,22.73) v1(41.15,19.93) v1(42.67,22.73) v1(42.67,19.93) v1(43.49,24.45) v1(43.49,6.67) v1(43.49,4.14) v1(43.49,1.59) v1(43.94,22.73) v1(43.94,19.93) v1(45.21,22.73) v1(45.21,19.93) v1(46.03,37.16) v1(46.03,34.61) v1(46.03,32.08) v1(46.03,29.53) v1(46.03,27) v1(46.03,24.45) v1(46.03,9.22) v1(46.03,6.67) v1(46.03,4.14) v1(46.03,1.59) v1(46.48,22.73) v1(46.48,19.93) v1(48.01,19.93) v1(48.56,37.16) v1(48.56,34.61) v1(48.56,32.08) v1(48.56,29.53) v1(48.56,27) v1(48.56,16.83) v1(48.56,14.3) v1(48.56,11.75) v1(48.56,9.22) v1(48.56,6.67) v1(48.56,4.14) v1(48.56,1.59) v1(49.53,19.93) v1(51.02,23) v1(51.1,34.61) v1(51.1,32.08) v1(51.1,27) v1(51.1,24.45) v1(51.05,19.93) v1(51.1,16.83) v1(51.1,14.3) v1(51.1,11.75) v1(51.1,9.22) v1(51.1,6.67) v1(51.1,4.14) v1(51.1,1.59) v1(52.32,22.98) v1(53.65,34.61) v1(53.65,32.08) v1(53.65,27) v1(53.65,24.45) v1(53.59,22.98) v1(53.65,14.3) v1(53.65,11.75) v1(53.65,9.22) v1(53.65,6.67) v1(53.65,4.14) v1(53.65,1.59) v1(54.36,20.7) v1(54.61,24) v1(55.63,24.76) v1(56.13,22.47) v1(56.19,37.16) v1(56.19,34.61) v1(56.19,32.08) v1(56.19,27) v1(56.19,11.75) v1(56.19,9.22) v1(56.19,6.67) v1(56.19,4.14) v1(56.19,1.59) v1(56.64,25.78) v1(56.9,22.98) v1(57.66,26.54) v1(57.66,24) v1(58.72,37.16) v1(58.72,34.61) v1(58.72,32.08) v1(58.72,29.53) v1(58.72,16.83) v1(58.72,14.3) v1(58.72,11.75) v1(58.72,9.22) v1(58.72,6.67) v1(58.72,4.14) v1(58.72,1.59) v1(58.93,26.54) v1(58.96,24.51) v1(59.94,16.38) v1(59.94,15.36) v1(59.94,14.35) v1(59.94,13.33) v1(60.2,26.54) v1(60.19,24.51) v1(60.71,12.31) v1(61.26,34.61) v1(61.26,32.08) v1(61.26,9.22) v1(61.26,6.67) v1(61.26,4.14) v1(61.26,1.59) v1(61.47,26.54) v1(61.47,24.51) v1(61.72,12.31) v1(62.74,26.54) v1(62.66,24.51) v1(62.99,12.31) v1(63.81,34.61) v1(63.81,32.08) v1(63.81,9.22) v1(63.81,6.67) v1(63.81,4.14) v1(63.81,1.59) v1(64.01,26.54) v1(64.01,24.51) v1(64.26,16.12) v1(64.26,12.31) v1(64.52,15.11) v1(65.02,19.17) v1(65.1,17.14) v1(65.28,26.54) v1(65.28,24.25) v1(65.52,14.85) v1(65.53,12.82) v1(66.04,23.49) v1(66.04,22.22) v1(66.04,20.95) v1(66.04,19.68) v1(66.34,37.16) v1(66.34,34.61) v1(66.34,32.08) v1(66.34,27) v1(66.29,26.28) v1(66.29,17.14) v1(66.34,9.22) v1(66.34,6.67) v1(66.34,4.14) v1(66.34,1.59) v1(66.55,12.82) v1(66.57,14.85) v1(67.06,25.52) v1(67.31,17.9) v1(67.56,14.85) v1(67.56,12.82) v1(67.82,24.76) v1(68.07,23.49) v1(68.07,22.47) v1(68.07,21.46) v1(68.07,20.19) v1(68.07,18.92) v1(68.58,14.85) v1(68.58,12.82) v1(68.88,37.16) v1(68.88,34.61) v1(68.88,32.08) v1(68.88,29.53) v1(68.88,27) v1(68.88,24.45) v1(68.88,21.92) v1(68.88,19.38) v1(68.88,16.83) v1(68.88,9.22) v1(68.88,6.67) v1(68.88,4.14) v1(68.88,1.59) v1(69.6,14.85) v1(69.6,12.82) v1(70.61,14.85) v1(70.61,12.82) v1(71.43,37.16) v1(71.43,34.61) v1(71.43,32.08) v1(71.43,29.53) v1(71.43,27) v1(71.43,24.45) v1(71.43,21.92) v1(71.43,19.38) v1(71.43,9.22) v1(71.43,6.67) v1(71.43,4.14) v1(71.43,1.59) v1(73.97,37.16) v1(73.97,32.08) v1(73.97,29.53) v1(73.97,27) v1(73.97,24.45) v1(73.97,21.92) v1(73.97,19.38) v1(73.97,16.83) v1(73.97,11.75) v1(73.97,9.22) v1(73.97,1.59) v1(76.5,37.16) v1(76.5,32.08) v1(76.5,29.53) v1(76.5,27) v1(76.5,24.45) v1(76.5,21.92) v1(76.5,19.38) v1(76.5,14.3) v1(76.5,9.22) v1(76.5,6.67) v1(76.5,1.59) v1(79.04,37.16) v1(79.04,34.61) v1(79.04,32.08) v1(79.04,29.53) v1(79.04,27) v1(79.04,24.45) v1(79.04,21.92) v1(79.04,19.38) v1(79.04,16.83) v1(79.04,14.3) v1(79.04,11.75) v1(79.04,9.22) v1(79.04,6.67) v1(79.04,4.14) v1(79.04,1.59)
FILTER1: length 5.5
  Top Layer w0.508: 100R.2 23.13,17.14 NE564.4
FILTER2: length 9.4
  Top Layer w0.508: 100R#2.2 22.88,14.6 NE564.5
FREQ1: length 11.8
  Top Layer w0.508: NE564.13 40.62,17.14 C16.1 45.5,16.87 C17.1
FREQ2: length 12.3
  Top Layer w0.508: C17.2 44.48,14.87 C16.2 40.62,14.6 NE564.12
$1N3: length 6.2
  Top Layer w0.762: C9.1 23.35,11.81 R15.2 26.91,11.79 NE564.6
$1N9: length 17.4
  Top Layer w0.508: NE564.3 29.99,16.87 0R.1
$1N11: length 6.2
  Top Layer w0.762: C12.2 R15.1 23.64,9.52 NE564.7
$1N13: length 11.4
  Top Layer w0.508: 2k#2.1 28.46,30.33 24.13,34.67 10k#2.2
$1N15: length 9.5
  Top Layer w0.508: 2k#2.2 30.99,22.98 30.23,22.22 NE564.2
$1N18: length 8.3
  Top Layer w0.508: R17.2 NE564.9 34.8,6.23 0R.2
$1N22: length 12.8
  Top Layer w0.508: R11.1 v1(44.7,9.28)
  Bottom Layer w0.508: NE564.11 41.93,12.06 v1(44.7,9.28)
$1N27: length 15.1
  Top Layer w0.508: 触发器输出.5 NE564.16 36.53,24.76 2k.2
$1N30: length 3.8
  Top Layer w0.508: 2k#3.2 10k.1
$1N31: length 10.3
  Top Layer w0.508: 2k#3.1 41.93,26.3 37.85,22.22 NE564.15
$1N32: length 6.3
  Top Layer w0.508: C7.1 38.62,19.68 NE564.14
$1N33: length 2.3
  Top Layer w0.508: C7.2 R8.1
$1N34: length 4.3
  Top Layer w0.508: R8.2 48.5,21.46 C5.1 49.04,21.46 R9.1
$1N52: length 2.3
  Top Layer w0.254: R1.1 LED1.1
$1N3078: length 2.1
  Top Layer w0.508: 100R.1 10nF#2.2
$1N3114: length 2.1
  Top Layer w0.508: 100R#2.1 10nF.2
$1N6036: length 28.9
  Top Layer w0.508: R9.2 55.17,21.46 GS2261.4 55.23,22.84 57.91,25.52 65.53,25.52 67.06,24 67.06,19.17 66.04,18.16 R4.1 62.98,16.42 C3.1
$1N6106: length 4
  Top Layer w0.508: R14.2 58.88,22.73 GS2261.3
$1N6224: length 8.4
  Top Layer w0.508: GS2261.1 58.88,18.16 R4.2 60.98,16.42 C3.2 61.23,16.08 C8.1
$1N6416: length 10.9
  Top Layer w0.508: C8.2 解调输出.5
$1N6764: length 4.9
  Top Layer w0.762: R10.2 16.49,11.81 R13.2 19.05,11.79 C9.2
$1N6766: length 7.6
  Top Layer w0.762: R10.1 12.19,11.79 R12.2 9.89,11.81 RFin.5

## Copper pours and planes (outline as drawn; the poured copper is in the pictures)
+5V on Top Layer: 52.32,19.93 56.58,19.93 56.58,16.12 52.32,16.12
+5V on Inner2: -1.78,43.05 82.04,43.05 82.04,-13.59 -1.78,-13.59
-5V on Top Layer: 58.67,21.97 61.72,21.97 61.72,19.05 58.67,19.05
-5V on Bottom Layer: -3.3,48.13 86.11,48.13 86.11,-2.16 -3.3,-2.16
GND on Top Layer: -14.48,49.65 90.68,49.65 90.68,-6.48 -14.48,-6.48
GND on Inner1: -8.89,47.37 88.65,47.37 88.65,-5.47 -8.89,-5.47

Small or netless copper shapes (teardrops, artwork), in the pictures only: 96 on Top Layer, 2 on Bottom Layer

## Text on the board
Top Silkscreen Layer: GND | +5V | 134zhou | -5V | NE564_V1.1 | 压控振荡器增益调节 | 触发器迟滞电压控制
